# EAGLE design PiZero_2.2TFT_Adapter (EAGLE 7.5.0)
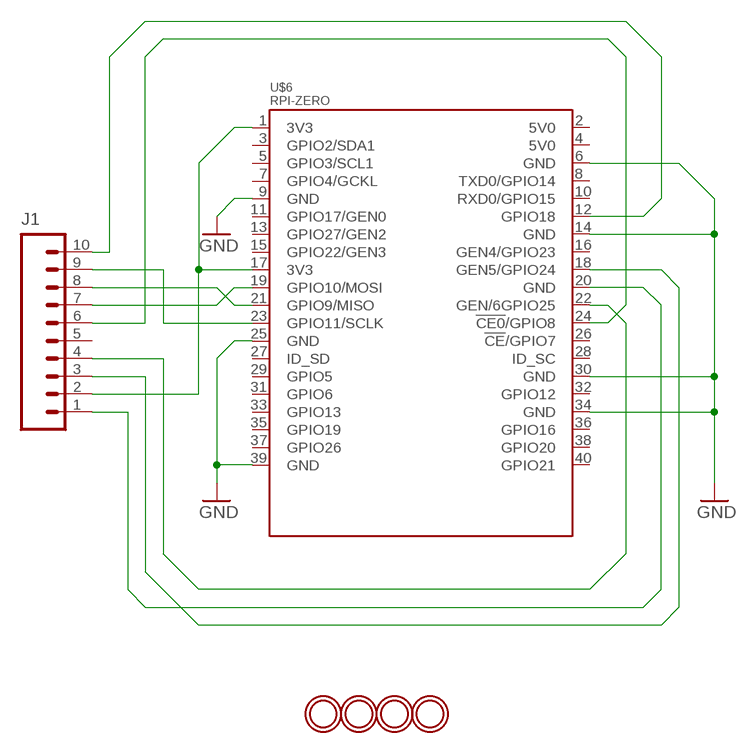
[diagram p0: schematic, sheet 1]

## Parts
J1  M10NO_SILK_PTH_FEMALE  [1X10_NO_SILK]
U$2  MOUNTINGHOLE2.5  [MOUNTINGHOLE_2.5_PLATED]
U$3  MOUNTINGHOLE2.5  [MOUNTINGHOLE_2.5_PLATED]
U$4  MOUNTINGHOLE2.5  [MOUNTINGHOLE_2.5_PLATED]
U$5  MOUNTINGHOLE2.5  [MOUNTINGHOLE_2.5_PLATED]
U$6  RPI-ZERO  [RASPBERRYPI_BASTELSTUBE_V13_RASPI_BOARD_B+_FULL]

## Nets
3V3: J1.2 U$6.1(3V3) U$6.17(3V3)
GND: J1.1 U$6.6(GND) U$6.9(GND) U$6.14(GND) U$6.20(GND) U$6.25(GND) U$6.30(GND) U$6.34(GND) U$6.39(GND)
N$1: J1.10 U$6.12(GPIO18)
N$2: J1.9 U$6.23(GPIO11/SCLK)
N$3: J1.8 U$6.21(GPIO9/MISO)
N$4: J1.7 U$6.19(GPIO10/MOSI)
N$5: J1.6 U$6.24(!CE0!/GPIO8)
N$6: J1.3 U$6.18(GEN5/GPIO24)
N$7: J1.4 U$6.22(GEN/6GPIO25)
Unconnected: J1.5 U$6.2(5V0) U$6.3(GPIO2/SDA1) U$6.4(5V0) U$6.5(GPIO3/SCL1) U$6.7(GPIO4/GCKL) U$6.8(TXD0/GPIO14) U$6.10(RXD0/GPIO15) U$6.11(GPIO17/GEN0) U$6.13(GPIO27/GEN2) U$6.15(GPIO22/GEN3) U$6.16(GEN4/GPIO23) U$6.26(!CE!/GPIO7) U$6.27(ID_SD) U$6.28(ID_SC) U$6.29(GPIO5) U$6.31(GPIO6) U$6.32(GPIO12) U$6.33(GPIO13) U$6.35(GPIO19) U$6.36(GPIO16) U$6.37(GPIO26) U$6.38(GPIO20) U$6.40(GPIO21)

## Library data of the parts
J1 = SparkFun-Connectors:M10: Header 10 Standard 10-pin 0.1" header. Use with straight break away headers (SKU : PRT-00116), right angle break away headers (PRT-00553), swiss pins (PRT-00743), machine pins (PRT-00117), and female headers (PRT-00115).; PROD_ID: CONN-11563
U$2-U$5 = microbuilder:MOUNTINGHOLE: Mounting Hole For #2 screws (0.086"/2.18mm width, 0.094"/2.4mm hole) use 2.5mm
U$6 = RPI-Zero:RPI-ZERO

## Board
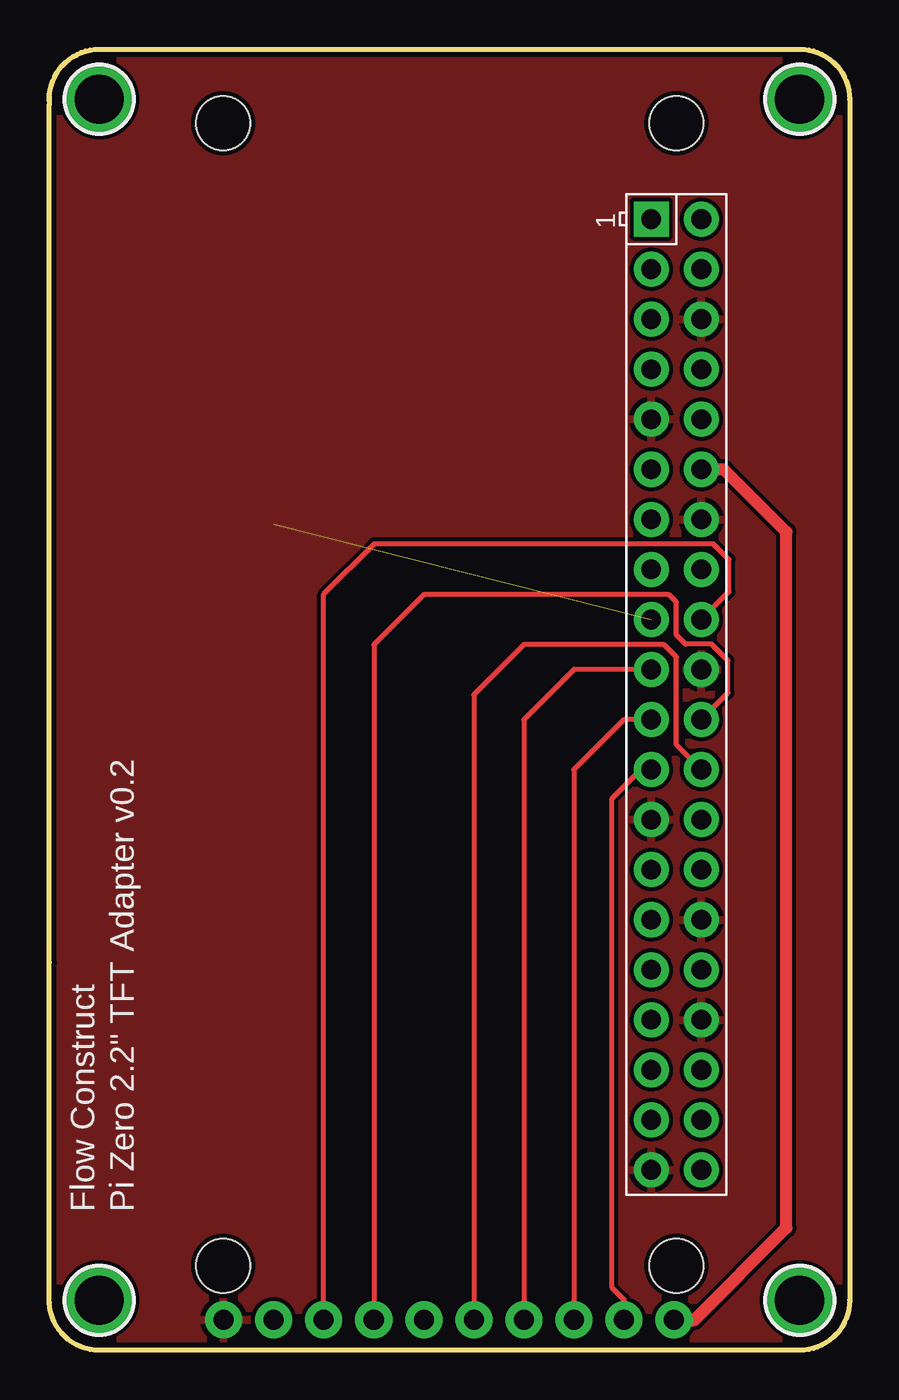
[diagram p1: board, top side]
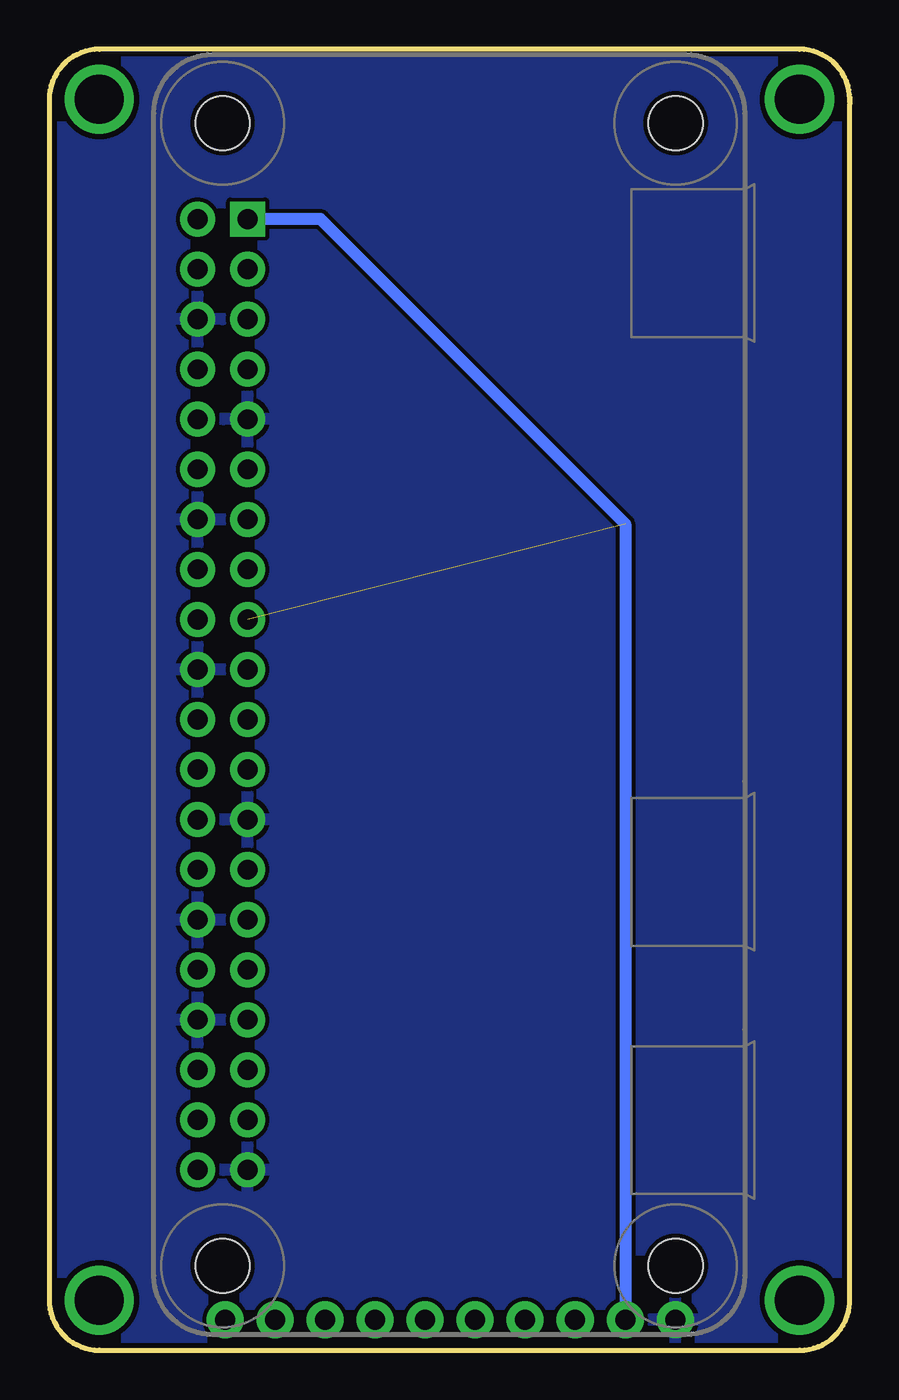
[diagram p2: board, bottom side, seen from below]

Size 40.64 x 66.04 mm. Coordinates in mm from the lower left corner, seen from the top.
Outline: 40.64,63.5 arc90 38.1,66.04
Outline: 2.54,66.04 arc90 0,63.5
Outline: 0,63.25 0,63.37 0,63.5
Outline: 0,19.68 0,2.54 arc90 2.54,0
Outline: 38.1,0 arc90 40.64,2.54
Outline: 38.1,66.04 arc-90 40.64,63.5
Outline: 40.64,63.5 40.64,2.54
Outline: 40.64,2.54 arc-90 38.1,0
Outline: 38.1,0 2.54,0
Outline: 2.54,0 arc-87 0,2.41 0,19.68
Outline: 0,19.68 0,63.25
Outline: 0,63.5 arc-90 2.54,66.04
Outline: 2.54,66.04 38.1,66.04
Outline: 0,63.63 0,63.25
Copper layers (1*16): Top 0.035mm / dielectric 1.5mm / Bottom 0.035mm
Design rules "adafruit": minimum track width 8mil, minimum drill 15.5mil, track to track 8mil, track to pad 8mil, pad to pad 8mil, via to via 8mil, smd to smd 8mil, copper to edge 10mil, drill to drill 8mil, minimum pad ring 10mil, minimum via ring 8mil, stop-mask expansion 4mil, vias tented up to drill 20mil, thermal gap 10mil

### Footprints (pad centres in the part's own frame; a part is rotated, then mirrored left to right if it is on the bottom)
1X10_NO_SILK = drill 1.016 pad 1.88: 1 0,0; 2 2.54,0; 3 5.08,0; 4 7.62,0; 5 10.16,0; 6 12.7,0; 7 15.24,0; 8 17.78,0; 9 20.32,0; 10 22.86,0
MOUNTINGHOLE_2.5_PLATED = drill 2.5 pad 3.2: P$1 0,0
RASPBERRYPI_BASTELSTUBE_V13_RASPI_BOARD_B+_FULL = drill 1 pad 1.778 square: 1 8.37,25.23 | drill 1 pad 1.778: 2 8.37,27.77; 3 10.91,25.23; 4 10.91,27.77; 5 13.45,25.23; 6 13.45,27.77; 7 15.99,25.23; 8 15.99,27.77; 9 18.53,25.23; 10 18.53,27.77; 11 21.07,25.23; 12 21.07,27.77; 13 23.61,25.23; 14 23.61,27.77; 15 26.15,25.23; 16 26.15,27.77; 17 28.69,25.23; 18 28.69,27.77; 19 31.23,25.23; 20 31.23,27.77; 21 33.77,25.23; 22 33.77,27.77; 23 36.31,25.23; 24 36.31,27.77; 25 38.85,25.23; 26 38.85,27.77; 27 41.39,25.23; 28 41.39,27.77; 29 43.93,25.23; 30 43.93,27.77; 31 46.47,25.23; 32 46.47,27.77; 33 49.01,25.23; 34 49.01,27.77; 35 51.55,25.23; 36 51.55,27.77; 37 54.09,25.23; 38 54.09,27.77; 39 56.63,25.23; 40 56.63,27.77 | hole 2.75: 3.5,3.5; 3.5,26.5; 61.5,3.5; 61.5,26.5

### Placement (x,y rotation side)
J1  8.86,1.56 0 top
U$2  2.54,2.54 0 top
U$3  38.1,63.5 0 top
U$4  2.54,63.5 0 top
U$5  38.1,2.54 0 top
U$6  5.33,65.79 270 top

### Tracks (layer width: path | path; a pad name or v marks a point on that pad's centre or on a via)
3V3  (1 unrouted)
  Bottom 0.61: J1.2 11.4,41.94 26.87,57.42 U$6.1
GND
  pour Bottom: -1.3,-2.51 41.88,-2.51 41.88,68.61 -1.3,68.61
  pour Top: -0.03,67.98 42.51,67.98 42.51,-1.87 -1.94,-1.87 -1.94,64.17 -1.94,67.98
N$1
  Top 0.61: J1.10 31.74,1.53 32.76,1.53 37.43,6.2 37.43,41.54 34.26,44.72 U$6.12
N$2
  Top 0.254: J1.9 29.18,2.57 28.54,3.21 28.54,27.97 30.05,29.48 U$6.23
N$3
  Top 0.254: J1.8 26.64,29.48 29.18,32.02 U$6.21
N$4
  Top 0.254: J1.7 24.1,32.02 26.64,34.56 U$6.19
N$5
  Top 0.254: U$6.24 31.85,30.73 31.85,35.19 31.21,35.82 24.1,35.82 21.56,33.28 J1.6
N$6
  Top 0.254: U$6.18 34.51,38.5 34.51,40.14 33.73,40.93 16.48,40.93 13.94,38.39 J1.3
N$7
  Top 0.254: U$6.22 34.46,33.37 34.46,35.01 33.62,35.85 32.3,35.85 31.85,36.3 31.85,37.98 31.46,38.36 19.02,38.36 16.48,35.82 J1.4

### Text on the board
tPlace: Flow Construct / Pi Zero 2.2" TFT Adapter v0.2